# Altium schematic sheet Robot Arm.SchDoc
size A
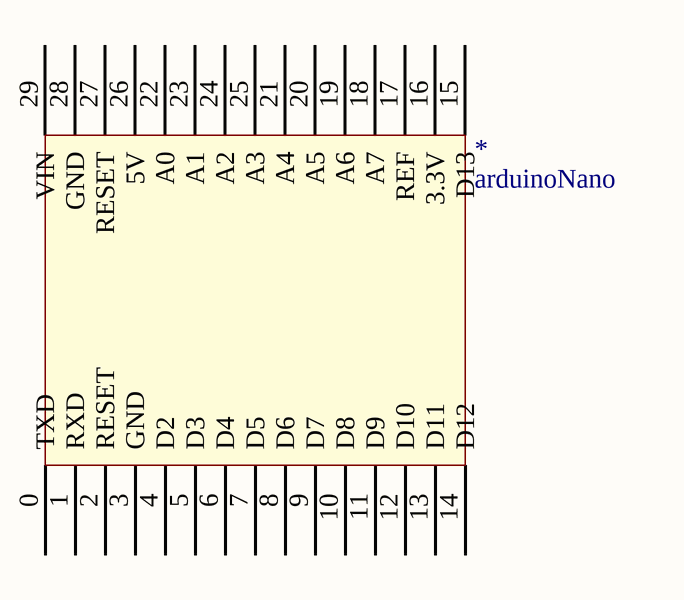
[diagram p0: Robot Arm.SchDoc]

## Parts
*  arduinoNano  [Arduino nano]

## Nets

Not connected (* = marked no-connect by the designer): * 0(TXD) 1(RXD) 2(RESET) 3(GND) 4(D2) 5(D3) 6(D4) 7(D5) 8(D6) 9(D7) 10(D8) 11(D9) 12(D10) 13(D11) 14(D12) 15(D13) 16(3.3V) 17(REF) 18(A7) 19(A6) 20(A5) 21(A4) 22(A0) 23(A1) 24(A2) 25(A3) 26(5V) 27(RESET) 28(GND) 29(VIN)